# Altium schematic sheet ltk-hall_main_gauss.SchDoc: MAIN / GAUSSMETER
size A3; Organization: Altium Limited; Address1: L3, 12a Rodborough Rd; Address2: Frenchs Forest; Address3: NSW; Address4: Australia 2086; DocumentNumber: 2; SheetNumber: 2; SheetTotal: 6
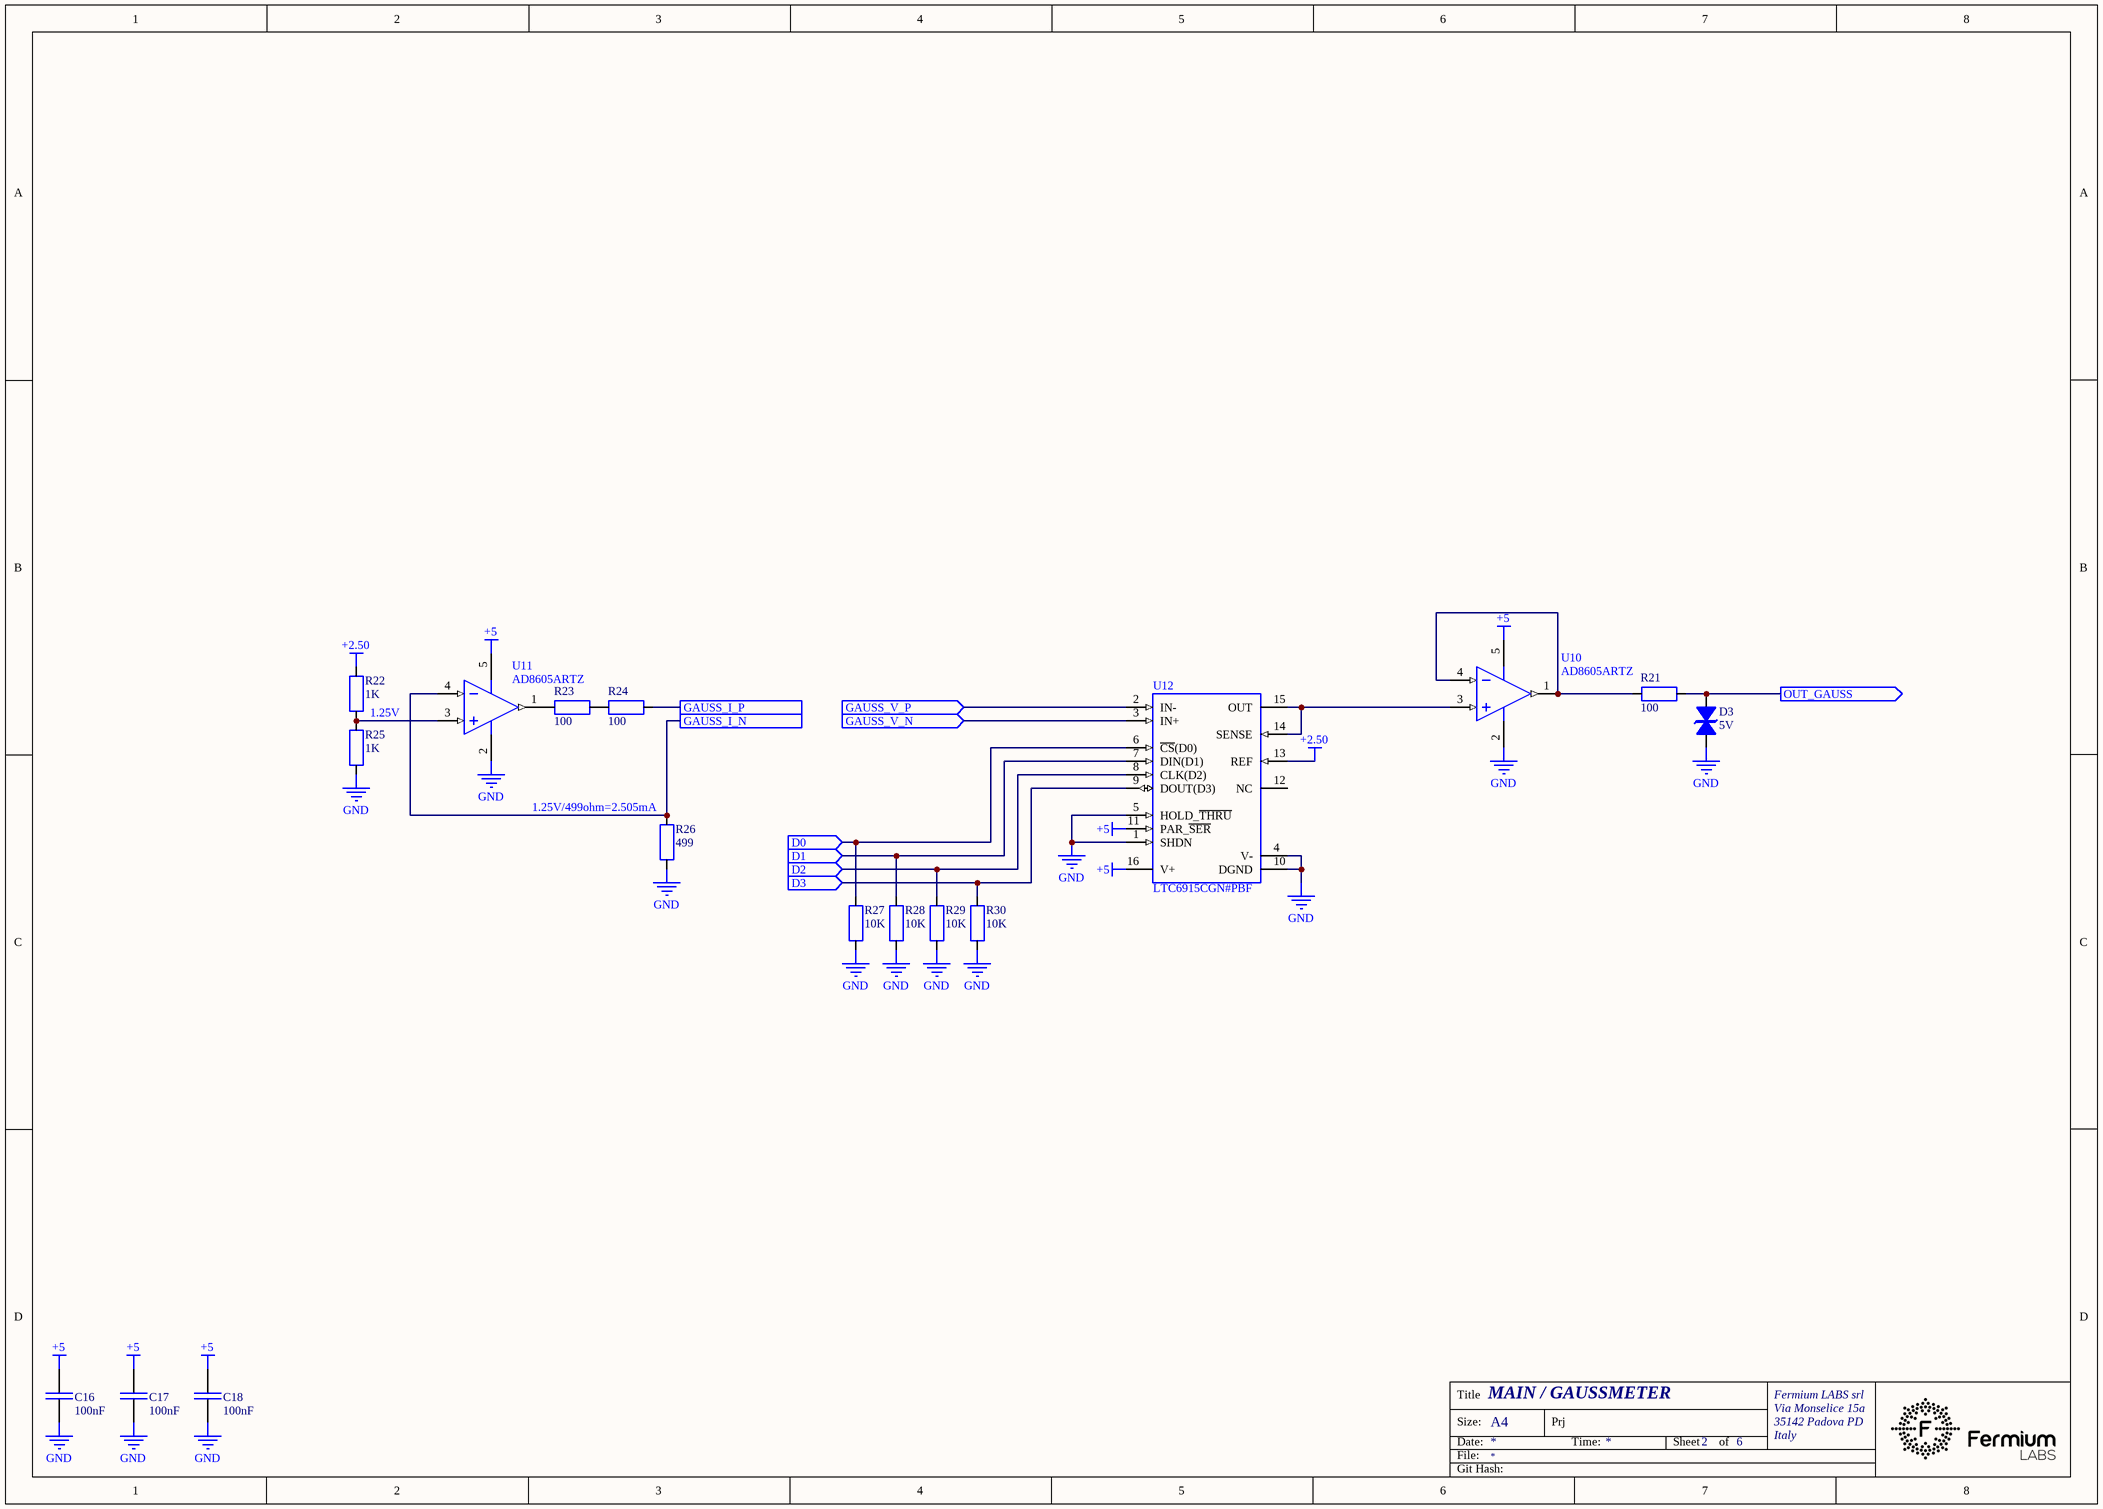
[diagram p0: ltk-hall_main_gauss.SchDoc]

## Parts
C16  100nF  [CAP 0603_1608]
C17  100nF  [CAP 0603_1608]
C18  100nF  [CAP 0603_1608]
D3  5V  [SOD523F]
R21  100  [RES 0603_1608]
R22  1K  [RES 0603_1608]
R23  100  [RES 0603_1608]
R24  100  [RES 0603_1608]
R25  1K  [RES 0603_1608]
R26  499  [RES 0603_1608]
R27  10K  [RES 0603_1608]
R28  10K  [RES 0603_1608]
R29  10K  [RES 0603_1608]
R30  10K  [RES 0603_1608]
U10  AD8605ARTZ  [A3DDA0BC-073E-4B18-9613-F713A7EC1E27]
U11  AD8605ARTZ  [A3DDA0BC-073E-4B18-9613-F713A7EC1E27]
U12  LTC6915CGN#PBF  [517EE8A2-9FD8-4174-996D-BDBF76CA3EEB]

## Ports
D0 (in), D1 (in), D2 (in), D3 (in), GAUSS_I_N, GAUSS_I_P, GAUSS_V_N (in), GAUSS_V_P (in), OUT_GAUSS (out)

## Nets
+2.50: R22.2 U12.13(REF)
+5: C16.1 C17.1 C18.1 U10.5(+V) U11.5(+V) U12.11(PAR_~{SER}) U12.16(V+)
GND: C16.2 C17.2 C18.2 D3.2 R25.1 R26.1 R27.1 R28.1 R29.1 R30.1 U10.2(-V) U11.2(-V) U12.1(SHDN) U12.4(V-) U12.5(HOLD_~{THRU}) U12.10(DGND)
D0: R27.2 U12.6(~{CS}(D0)) ; port D0
D1: R28.2 U12.7(DIN(D1)) ; port D1
D2: R29.2 U12.8(CLK(D2)) ; port D2
D3: R30.2 U12.9(DOUT(D3)) ; port D3
GAUSS_I_N: R26.2 U11.4(-IN) ; port GAUSS_I_N
GAUSS_I_P: R24.2 ; port GAUSS_I_P
GAUSS_V_N: U12.3(IN+) ; port GAUSS_V_N
GAUSS_V_P: U12.2(IN-) ; port GAUSS_V_P
OUT_GAUSS: D3.1 R21.2 ; port OUT_GAUSS
NetR21_1: R21.1 U10.1(OUT) U10.4(-IN)
NetR22_1: R22.1 R25.2 U11.3(+IN)
NetR23_1: R23.1 U11.1(OUT)
NetR23_2: R23.2 R24.1
NetU10_3: U10.3(+IN) U12.14(SENSE) U12.15(OUT)

Not connected (* = marked no-connect by the designer): U12 12(NC)

## Notes on the sheet
- 1.25V
- (near R26) 1.25V/499ohm=2.505mA
- Title
- Fermium LABS srl
- Size:
- Date:
- File:
- A4
- Prj
- Time:
- Sheet
- of
- Via Monselice 15a
- 35142 Padova PD
- Italy
- Git Hash:

## Library data of the parts
C16-C18 = 02841f84-ac15-41b5-9e17-915f8f067828: CAP SMD MLCC 100nF 25V 0603 X7R; Manufacturer 1: Samsung Electro-Mechanics; Manufacturer Part Number 1: CL10B104KA8NNNC; id: 14784; S 1: LCSC; SPN 1: C1590; SPN 2: C14663; Part Number: 02841f84-ac15-41b5-9e17-915f8f067828; ComponentLink1Description: Datasheet; ComponentLink1URL: http://localhost:8080/static/files/Samsung-Electro-Mechanics-CL10B104KA8NNNC_C15902019-03-10_215548.826887.pdf?Samsung-Electro-Mechanics-CL10B104KA8NNNC_C1590.pdf; Value: 100nF; Manufacturer 2: Yageo; Manufacturer Part Number 2: CC0603KRX7R9BB104; S 2: LCSC
D3 = daa58212-38e2-4326-a156-8e48058c46f1: DIODE SMD TVS 5V BIDIRECTIONAL SOD-523; Manufacturer 1: Born Semiconductor; Manufacturer Part Number 1: PESD5V0S1BBN; id: 14837; S 1: LCSC; SPN 1: C314264; SPN 2: C97640; Part Number: daa58212-38e2-4326-a156-8e48058c46f1; ComponentLink1Description: Datasheet; ComponentLink1URL: http://localhost:8080/static/files/Nexperia-PESD5V0S1BB-115_C976402019-08-16_201905.624024.pdf?Nexperia-PESD5V0S1BB-115_C97640.pdf; ComponentLink2Description: Datasheet; ComponentLink2URL: http://localhost:8080/static/files/1901051701_Bourne-Semicon-Shenzhen-PESD5V0S1BBN_C3142642019-08-16_201911.992552.pdf?1901051701_Bourne-Semicon-Shenzhen-PESD5V0S1BBN_C314264.pdf; Manufacturer 2: Nexperia; Manufacturer Part Number 2: PESD5V0S1BB,115; Value: 5V; S 2: LCSC
R21 R23 R24 = 0a6c4b74-f837-4563-b154-6e196d753525: RES SMD 100 OHM 1% 1/10W 0603; Manufacturer 1: Yageo; Manufacturer Part Number 1: RC0603FR-07100RL; id: 12301; S 1: LCSC; SPN 1: C105588; SPN 2: C22775; Part Number: 0a6c4b74-f837-4563-b154-6e196d753525; Value: 100; Manufacturer 2: Uniroyal; Manufacturer Part Number 2: 0603WAF1000T5E; S 2: LCSC
R22 R25 = a678220f-9e9d-4863-a833-9993504f723c: RES SMD 1K OHM 1% 1/10W 0603; Manufacturer 1: Yageo; Manufacturer Part Number 1: RC0603FR-071KL; id: 14794; S 1: LCSC; SPN 1: C21190; SPN 2: C22548; Part Number: a678220f-9e9d-4863-a833-9993504f723c; Value: 1K; Manufacturer 2: Uniroyal; Manufacturer Part Number 2: 0603WAF1001T5E; S 2: LCSC
R26 = 3a10051a-dd65-4121-b0b9-1b40351a1843: RES SMD 499 OHM 1% 1/10W 0603; Manufacturer 1: Yageo; Manufacturer Part Number 1: RC0603FR-07499RL; id: 12368; S 1: LCSC; SPN 1: C23065; Part Number: 3a10051a-dd65-4121-b0b9-1b40351a1843; Value: 499; Manufacturer 2: Uniroyal; Manufacturer Part Number 2: 0603WAF4990T5E
R27-R30 = 93242766-ba1d-462d-b58f-ce1dfc4129c8: RES SMD 10K OHM 1% 1/10W 0603; Manufacturer 1: Yageo; Manufacturer Part Number 1: RC0603FR-0710KL; id: 12101; S 1: LCSC; SPN 1: C98220; SPN 2: C25804; Part Number: 93242766-ba1d-462d-b58f-ce1dfc4129c8; Value: 10K; Manufacturer 2: Uniroyal; Manufacturer Part Number 2: 0603WAF1002T5E; S 2: LCSC
U10 U11 = 5610e9ea-bca8-49b2-8e5f-11409231f6a4: IC OPAMP 65uV 1pA RRIO 5V 80mA SOT-23-5; Manufacturer 1: Analog Devices; id: 14830; S 1: LCSC; SPN 1: C9641; Part Number: 5610e9ea-bca8-49b2-8e5f-11409231f6a4; ComponentLink1Description: Datasheet; ComponentLink1URL: http://localhost:8080/static/files/Analog_Devices-AD8605ARTZ-REEL7-datasheet2019-08-16_175825.352099.pdf?Analog_Devices-AD8605ARTZ-REEL7-datasheet.pdf; Manufacturer Part Number 1: AD8605ARTZ
U12 = 59fe82cd-fd18-4813-9f52-e2e78a460aff: IC PGA G0-4094 SPI-PARALLEL 5V RRIO SSOP-16; Manufacturer 1: Analog Devices; id: 14835; S 1: Mouser; SPN 1: 584-LTC6915CGN#PBF; Part Number: 59fe82cd-fd18-4813-9f52-e2e78a460aff; ComponentLink1Description: Datasheet; ComponentLink1URL: http://localhost:8080/static/files/Linear_Technology-LTC6915CDEPBF-datasheet2019-08-16_194420.284095.pdf?Linear_Technology-LTC6915CDE#PBF-datasheet.pdf; Manufacturer Part Number 1: LTC6915CGN#PBF